# Altium project 封装库.PrjPcb
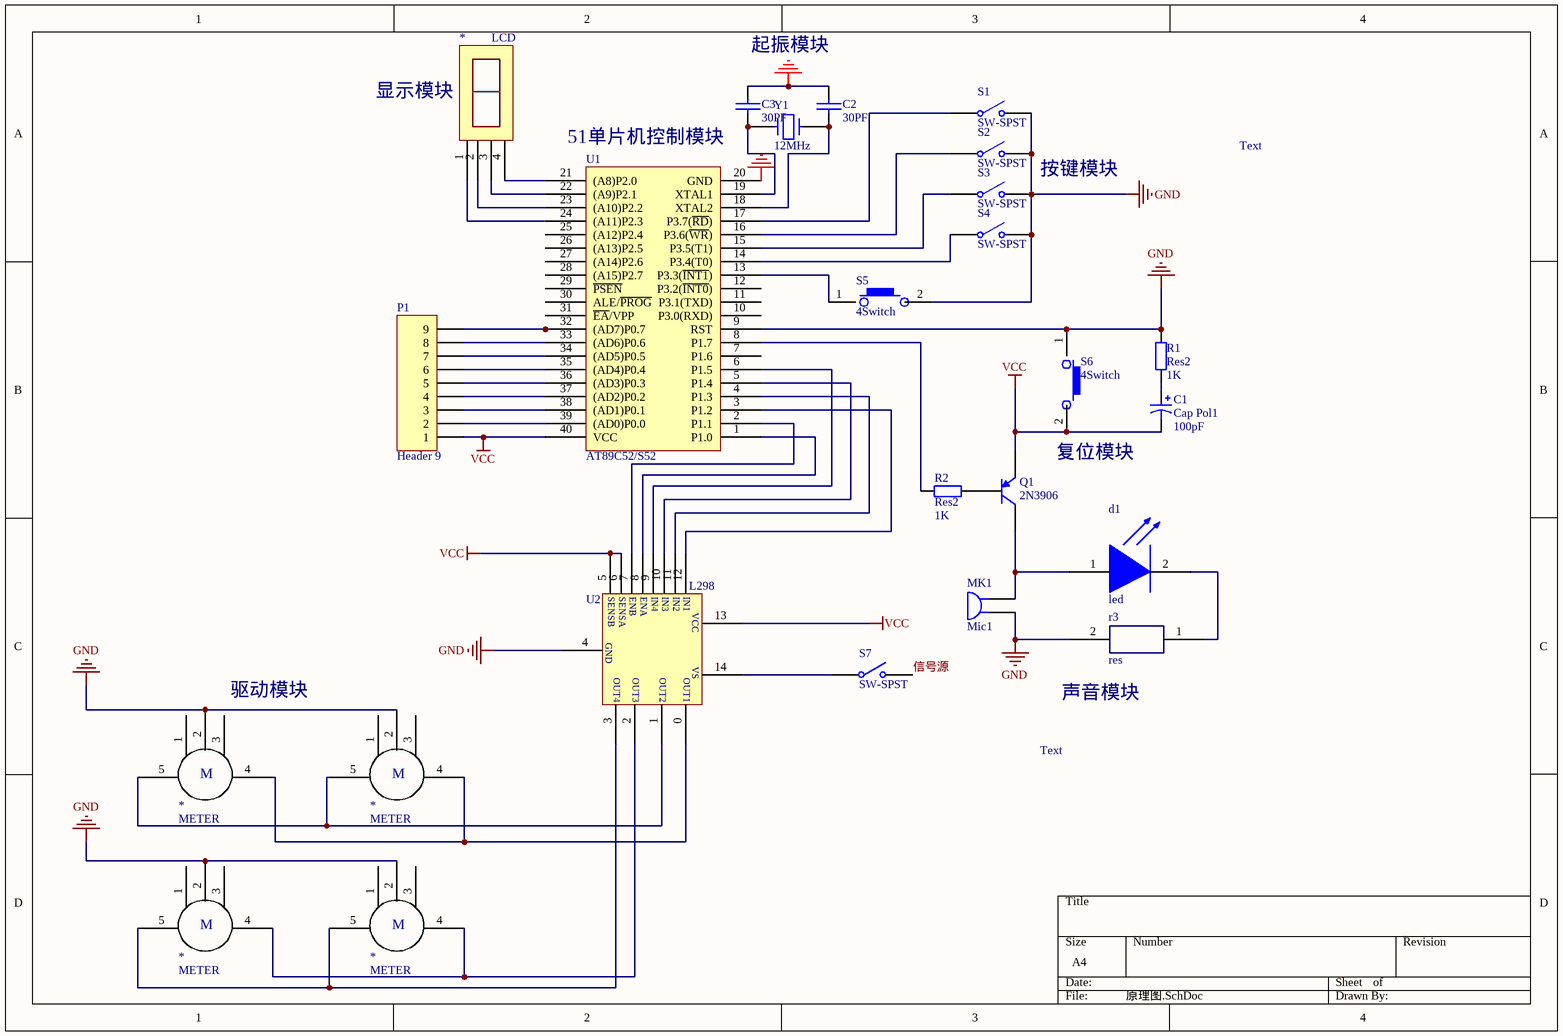
[diagram p0: 原理图.SchDoc]
1 sheet, 25 parts. Net scope: global (net labels, ports and power ports of the same name join across sheets).
Board file: PCB1.PcbDoc

## Sheet 原理图.SchDoc
size A4

### Parts
(Parts that share a designator on the sheet are numbered #1, #2 ... from top to bottom, then left to right.)
*#1  LCD  [SMG 0.39-1P]
*#2  METER  [XH2.54-LI-5P]
*#3  METER  [XH2.54-LI-5P]
*#4  METER  [XH2.54-LI-5P]
*#5  METER  [XH2.54-LI-5P]
C1  Cap Pol1  value 100pF  [CC 1.8*3.6]
C2  30PF  [RAD0.1]
C3  30PF  [RAD0.1]
d1  led  [LED 3MM-G]
MK1  Mic1  [PIN2]
P1  Header 9  [R SIP9-2.54]
Q1  2N3906  [TO-92A]
R1  Res2  value 1K  [AXIAL0.4-1/4W]
R2  Res2  value 1K  [AXIAL0.4-1/4W]
r3  res  [AXIAL0.4-1/4W]
S1  SW-SPST  [SPST-2]
S2  SW-SPST  [SPST-2]
S3  SW-SPST  [SPST-2]
S4  SW-SPST  [SPST-2]
S5  4Switch  [TSW DIP-6*6*5]
S6  4Switch  [TSW DIP-6*6*5]
S7  SW-SPST  [SPST-2]
U1  AT89C52/S52  [DIP-40]
U2  L298  [PCBComponent_1 - duplicate]
Y1  12MHz  [XTAL]

### Nets
GND: *#2.2 *#3.2 *#4.2 *#5.2 C2.2 C3.2 MK1.1 R1.2 r3.2 S1.2(NO) S2.2(NO) S3.2(NO) S4.2(NO) S5.2 S6.1 U1.9(RST) U1.20(GND) U2.4
VCC: C1.2 P1.1 Q1.1(E) S6.2 U1.40(VCC) U2.5 U2.6 U2.13
信号源: S7.2(NO)
Net*#1_1: *#1.1 U1.24((A11)P2.3)
Net*#1_2: *#1.2 U1.23((A10)P2.2)
Net*#1_3: *#1.3 U1.22((A9)P2.1)
Net*#1_4: *#1.4 U1.21((A8)P2.0)
Net*#2_4: *#2.4 *#3.4 U2.0
Net*#2_5: *#2.5 *#3.5 U2.1
Net*#4_4: *#4.4 *#5.4 U2.2
Net*#4_5: *#4.5 *#5.5 U2.3
NetC1_1: C1.1 R1.1
NetC2_1: C2.1 U1.18(XTAL2) Y1.1
NetC3_1: C3.1 U1.19(XTAL1) Y1.2
Netd1_1: d1.1 MK1.2 Q1.3(C)
Netd1_2: d1.2 r3.1
NetP1_2: P1.2 U1.39((AD0)P0.0)
NetP1_3: P1.3 U1.38((AD1)P0.1)
NetP1_4: P1.4 U1.37((AD2)P0.2)
NetP1_5: P1.5 U1.36((AD3)P0.3)
NetP1_6: P1.6 U1.35((AD4)P0.4)
NetP1_7: P1.7 U1.34((AD5)P0.5)
NetP1_8: P1.8 U1.33((AD6)P0.6)
NetP1_9: P1.9 U1.32((AD7)P0.7)
NetQ1_2: Q1.2(B) R2.2
NetR2_1: R2.1 U1.8(P1.7)
NetS1_1: S1.1(COMMON) U1.17(P3.7(~{RD}))
NetS2_1: S2.1(COMMON) U1.16(P3.6(~{WR}))
NetS3_1: S3.1(COMMON) U1.15(P3.5(T1))
NetS4_1: S4.1(COMMON) U1.14(P3.4(T0))
NetS5_1: S5.1 U1.13(P3.3(~{INT1}))
NetS7_1: S7.1(COMMON) U2.14
NetU1_1: U1.1(P1.0) U2.8
NetU1_2: U1.2(P1.1) U2.7
NetU1_3: U1.3(P1.2) U2.12
NetU1_4: U1.4(P1.3) U2.11
NetU1_5: U1.5(P1.4) U2.10
NetU1_6: U1.6(P1.5) U2.9

Not connected (* = marked no-connect by the designer): *#2 1 3; *#3 1 3; *#4 1 3; *#5 1 3; U1 7(P1.6) 10(P3.0(RXD)) 11(P3.1(TXD)) 12(P3.2(~{INT0})) 25((A12)P2.4) 26((A13)P2.5) 27((A14)P2.6) 28((A15)P2.7) 29(~{PSEN}) 30(ALE/~{PROG}) 31(~{EA}/VPP)

### Notes on the sheet
- 显示模块
- 起振模块
- (near U1) 51单片机控制模块
- 按键模块
- Text
- 复位模块
- (near *#2) 驱动模块
- (near r3) 声音模块
- (in symbol L298) SENSB; SENSA; ENB; ENA; IN4; IN3; IN2; IN1; VCC; GND; VS; OUT4; OUT3; OUT2; OUT1
- (in symbol METER) M

### Library data of the parts
C1 = Cap Pol1: Polarized Capacitor (Radial); Published: 8-Jun-2000; LatestRevisionDate: 17-Jul-2002; LatestRevisionNote: Re-released for DXP Platform.; PackageReference: RB7.6-15; Publisher: Altium Limited
C2 C3 = CAP: Capacitor
MK1 = Mic1: Microphone; Published: 24-Mar-1999; LatestRevisionDate: 17-Jul-2002; LatestRevisionNote: Re-released for DXP Platform.; PackageReference: PIN2; Publisher: Altium Limited
P1 = Header 9: Header, 9-Pin; LatestRevisionDate: 17-Jul-2002; LatestRevisionNote: Re-released for DXP Platform.; Publisher: Altium Limited
Q1 = 2N3906: PNP General Purpose Amplifier; Published: 8-Jun-2000; LatestRevisionDate: 15-Jan-2003; LatestRevisionNote: PCB Footprint 'BCY-W3/D4.7' replaced; DatasheetDocument: 1997; PackageDocument: Sep-1998; PackageReference: TO-92A; Publisher: Altium Limited; Code_JEDEC: TO-92A; ComponentLink1Description: Manufacturer Link; ComponentLink1URL: http://www.fairchildsemi.com/; ComponentLink2Description: Datasheet; ComponentLink2URL: http://www.fairchildsemi.com/ds/2N%2F2N3906.pdf
R1 R2 = Res2: Resistor; Published: 8-Jun-2000; LatestRevisionDate: 17-Jul-2002; LatestRevisionNote: Re-released for DXP Platform.; PackageReference: AXIAL-0.4; Publisher: Altium Limited
S1-S4 S7 = SW-SPST: Single-Pole, Single-Throw Switch; Published: 24-Mar-1999; LatestRevisionDate: 17-Jul-2002; LatestRevisionNote: Re-released for DXP Platform.; PackageReference: SPST-2; Publisher: Altium Limited
U1 = AT89C51
Y1 = CRYSTAL